# EasyEDA schematic SCH_d_02_e_00.json
TITLE: Sheet_1; REV: 1.0; Date: 2025-01-15; Sheet: 1/1; Drawn By: artem.v.ulyanov; Company: Your Company
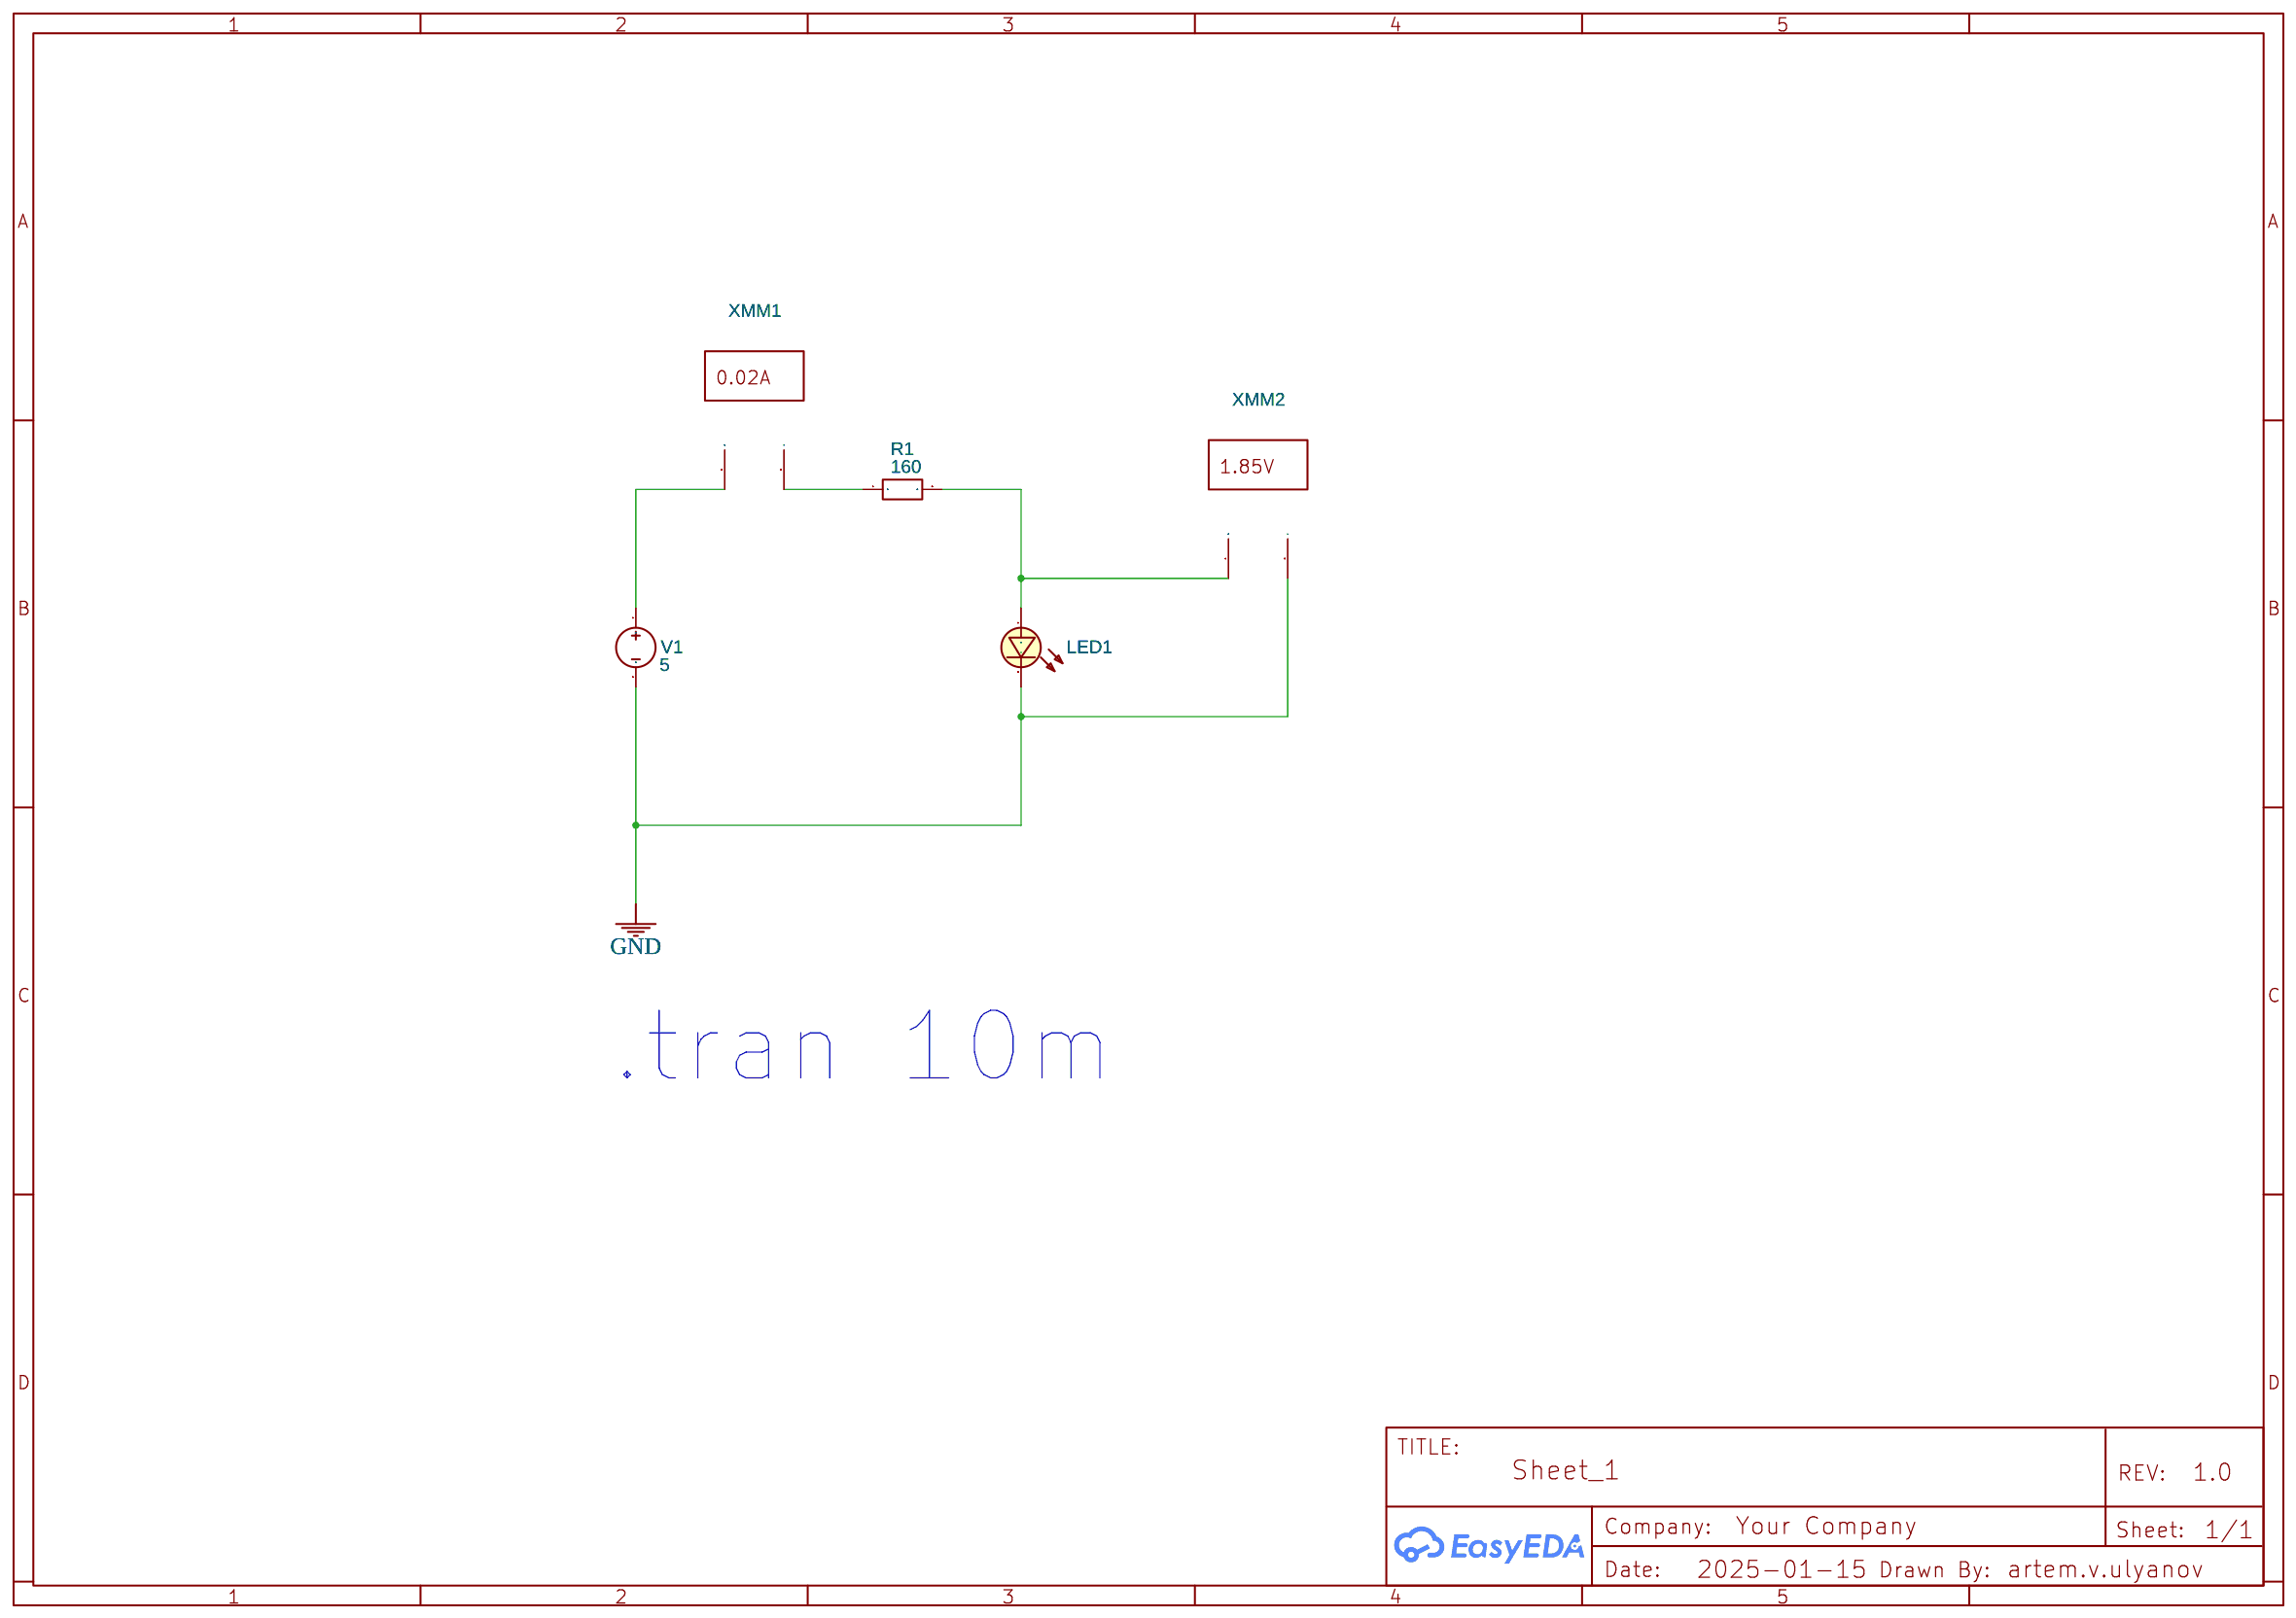
[diagram p0: schematic sheet]

## Parts
LED1  LED
R1  160  [R0603]
V1  5  [HDR1X2]
XMM1  Multimeter
XMM2  Multimeter

## Library data of the parts
LED1 = LED: catid: 20; Contributor: 仿真库绘制; Color: Red; NameDisplay: 0
R1 = R_0603_EU: Contributor: LCEDA_Lib
V1 = VDC: Contributor: EasyEDA; sim: true
XMM1 = MULTIMETER: Supplier: LCSC; Multimeter Type: Amper; Power Type: AC; Voltmeter resistance: 10μ; Ammeter resistance: 1G; NameDisplay: 0; Contributor: EasyEDA; sim: true
XMM2 = MULTIMETER: Supplier: LCSC; Multimeter Type: Voltmeter; Power Type: AC; Voltmeter resistance: 10μ; Ammeter resistance: 1G; NameDisplay: 0; Contributor: EasyEDA; sim: true

## Nets
GND: LED1.2(-) V1.2 XMM2.2(I)
Net-(LED1-1): LED1.1(+) R1.2 XMM2.1(+)
Net-(R1-1): R1.1 XMM1.2(I)
Net-(V1-1): V1.1 XMM1.1(+)

## Notes on the sheet
- .tran 10m
